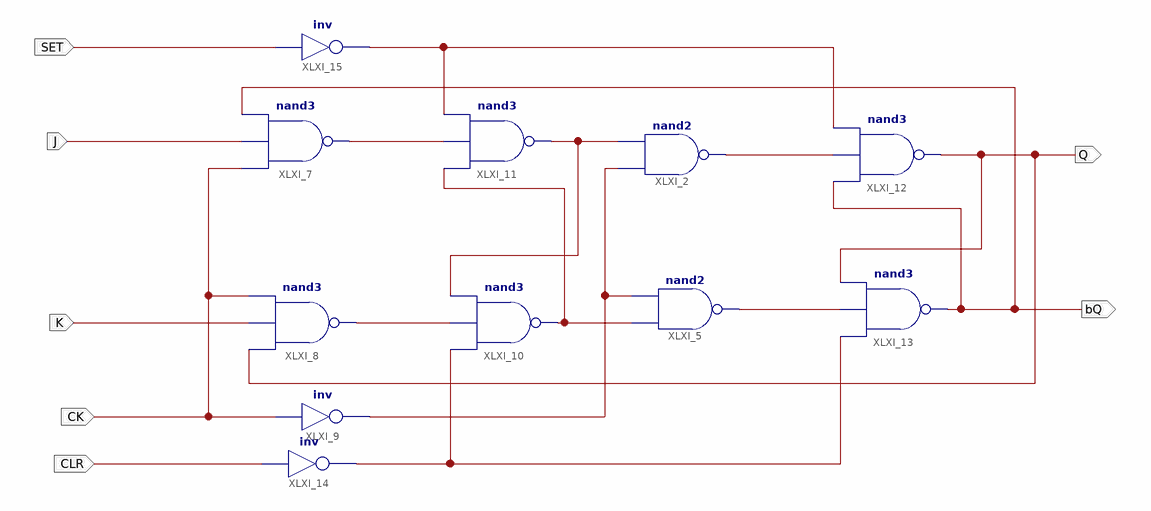
[diagram p0: schematic sheet 1]
// Xilinx ISE schematic JK_FF_NE.sch (spartan6) as structural Verilog: 11 symbols, 7 ports
module JK_FF_NE (
  input  CK,
  input  J,
  input  K,
  input  CLR,
  input  SET,
  output bQ,
  output Q
);

  wire XLXN_14, XLXN_21, XLXN_22, XLXN_23, XLXN_24, XLXN_26, XLXN_28, XLXN_49, XLXN_52;

  nand XLXI_2 (XLXN_26, XLXN_14, XLXN_23);
  nand XLXI_5 (XLXN_28, XLXN_21, XLXN_14);
  nand XLXI_7 (XLXN_22, CK, J, bQ);
  nand XLXI_8 (XLXN_24, Q, K, CK);
  not XLXI_9 (XLXN_14, CK);
  nand XLXI_10 (XLXN_21, XLXN_49, XLXN_24, XLXN_23);
  nand XLXI_11 (XLXN_23, XLXN_21, XLXN_22, XLXN_52);
  nand XLXI_12 (Q, bQ, XLXN_26, XLXN_52);
  nand XLXI_13 (bQ, XLXN_49, XLXN_28, Q);
  not XLXI_14 (XLXN_49, CLR);
  not XLXI_15 (XLXN_52, SET);
endmodule
